# EAGLE schematic tracker (EAGLE 7.4.0)
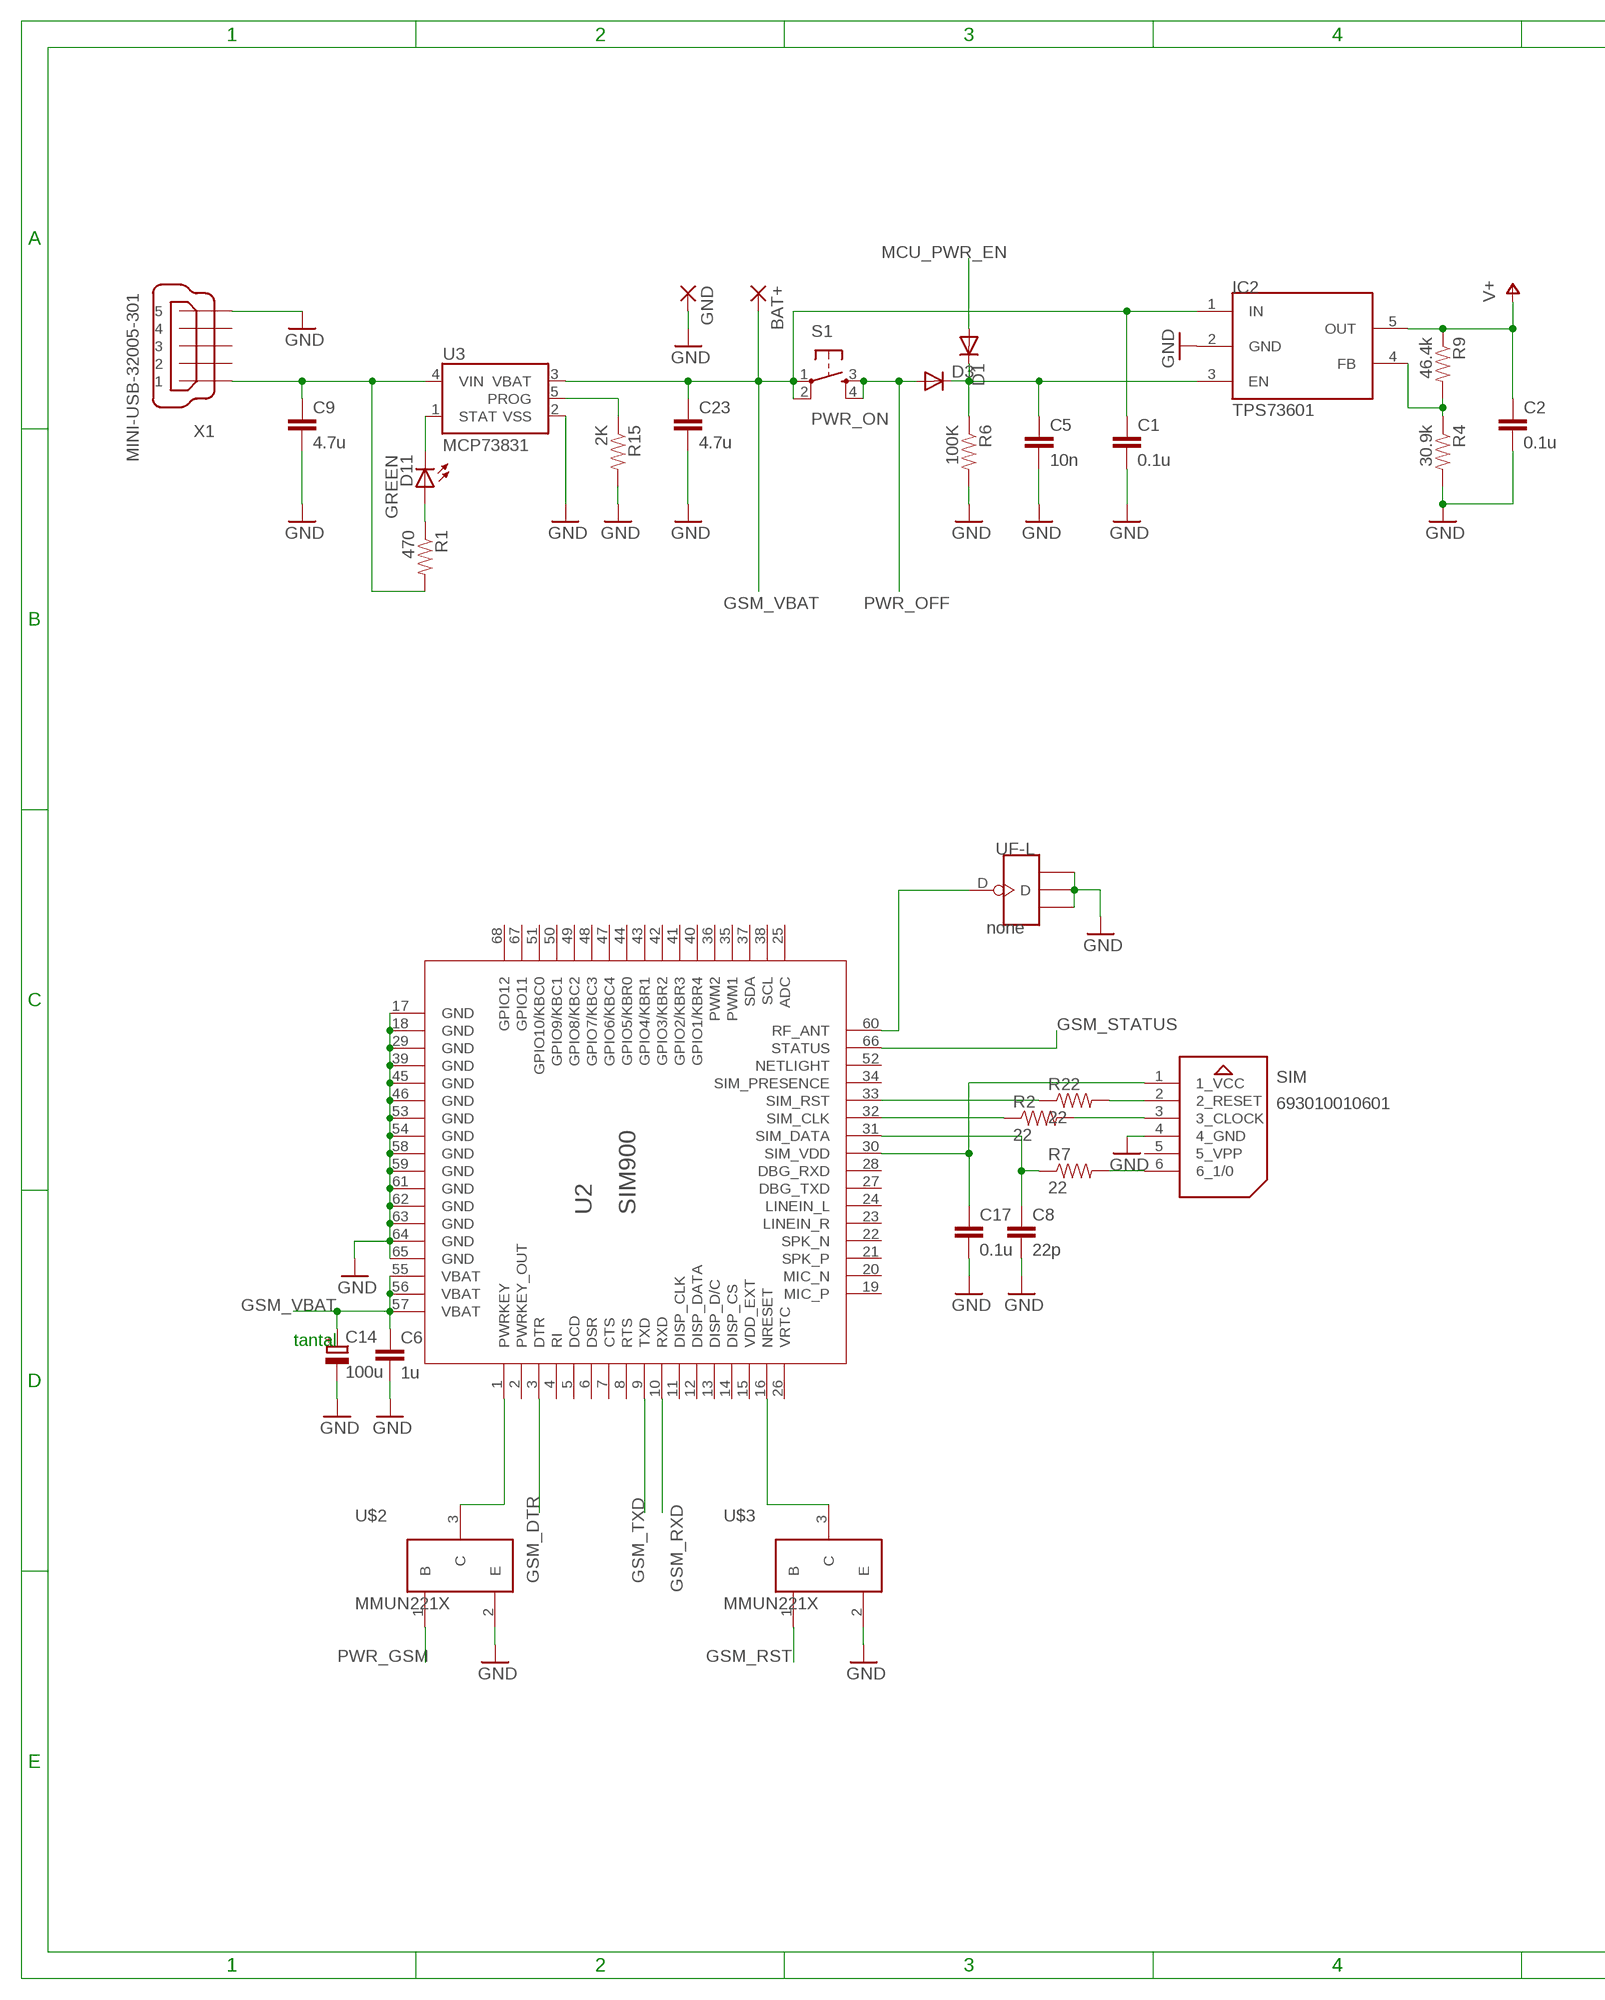
[diagram p0: schematic, sheet 1, part 1 of 2]
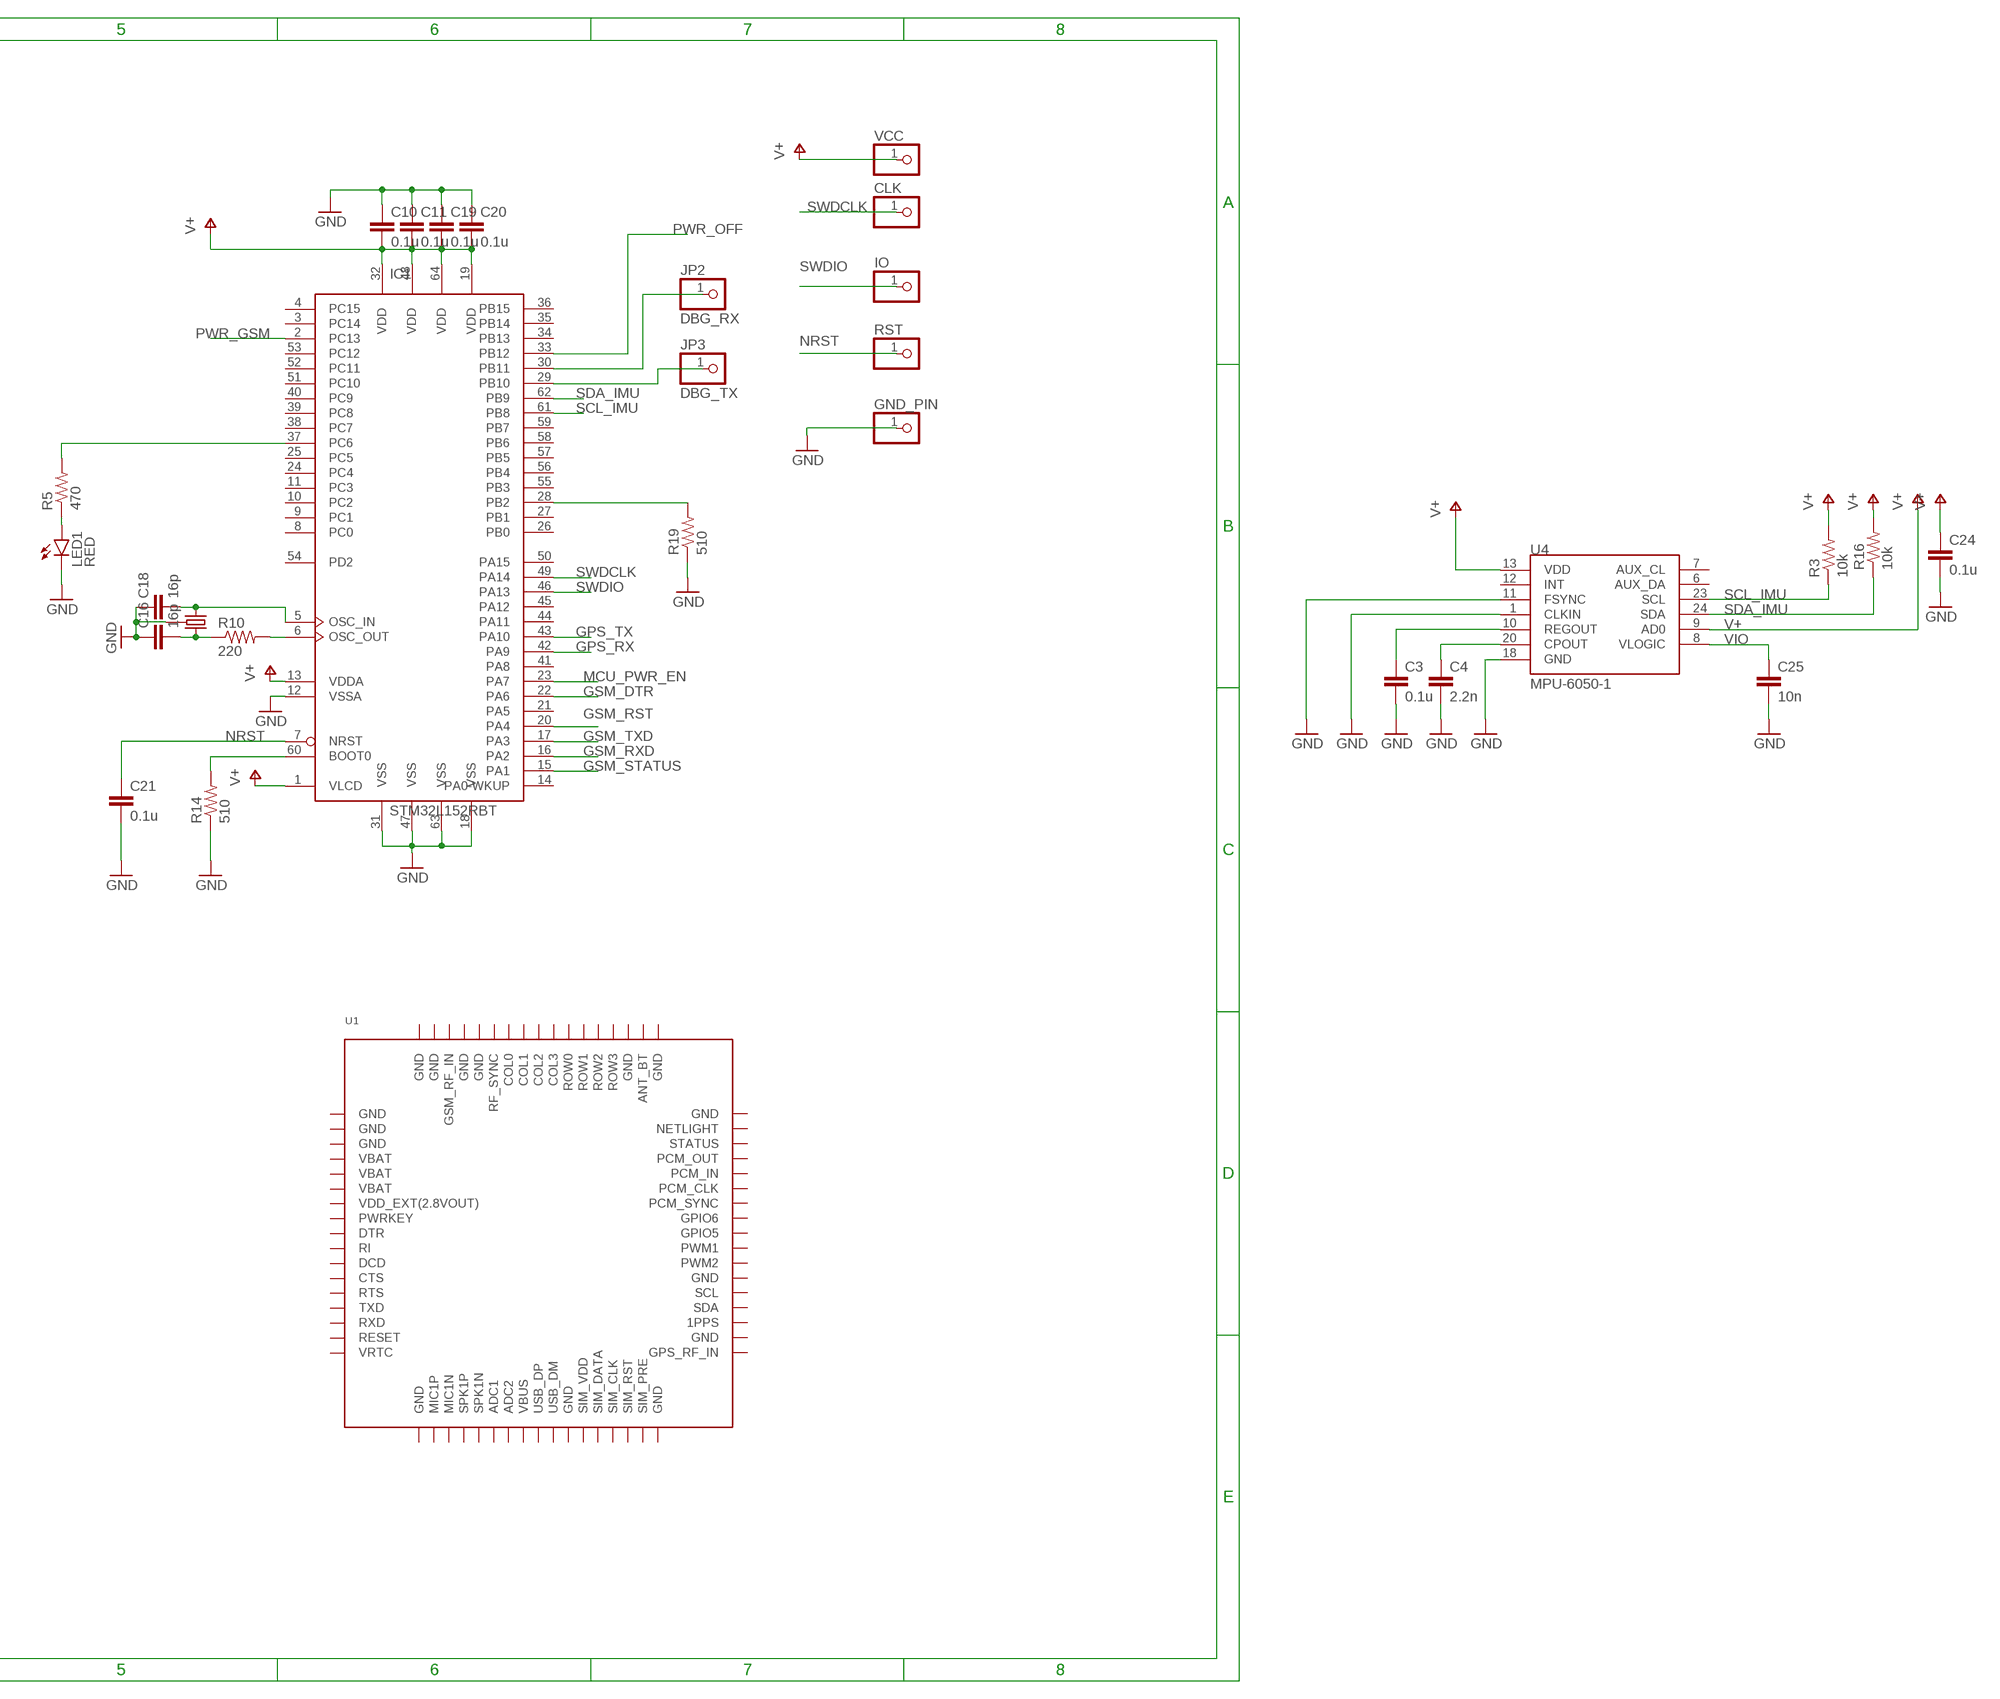
[diagram p1: schematic, sheet 1, part 2 of 2]

## Parts
BAT+  SMD2  [SMD1,27-2,54]
C1  0.1u  CAP0805  [0805]
C2  0.1u  CAP0805  [0805]
C3  0.1u  CAP0805  [0805]
C4  2.2n  CAP0805  [0805]
C5  10n  CAP0805  [0805]
C6  1u  CAP0805  [0805]
C8  22p  CAP0805  [0805]
C9  4.7u  CAP0805  [0805]
C10  0.1u  CAP0805  [0805]
C11  0.1u  CAP0805  [0805]
C14  100u  CPOL-EUC/6032-28R  [C/6032-28R]
C16  16p  CAP0603-CAP  [0603-CAP]
C17  0.1u  CAP0805  [0805]
C18  16p  CAP0603-CAP  [0603-CAP]
C19  0.1u  CAP0805  [0805]
C20  0.1u  CAP0805  [0805]
C21  0.1u  CAP0805  [0805]
C23  4.7u  CAP0805  [0805]
C24  0.1u  CAP0805  [0805]
C25  10n  CAP0805  [0805]
CLK  PINHD-1X1  [1X01]
D1  MBR0520LT  [SOD123]
D3  MBR0520LT  [SOD123]
D11  GREEN  LED0603  [LED-0603]
GND  SMD2  [SMD1,27-2,54]
GND_PIN  PINHD-1X1  [1X01]
IC1  STM32L152RBT  [LQFP64]
IC2  TPS73601  [SOT23]
IO  PINHD-1X1  [1X01]
JP2  DBG_RX  PINHD-1X1  [1X01]
JP3  DBG_TX  PINHD-1X1  [1X01]
LED1  RED  LED-RED0603  [LED-0603]
R1  470  RESISTOR0805-RES  [0805]
R2  22  RESISTOR0805-RES  [0805]
R3  10k  RESISTOR0805-RES  [0805]
R4  30.9k  RESISTOR0805-RES  [0805]
R5  470  RESISTOR0805-RES  [0805]
R6  100K  RESISTOR0805-RES  [0805]
R7  22  RESISTOR0805-RES  [0805]
R9  46.4k  RESISTOR0805-RES  [0805]
R10  220  RESISTOR0805-RES  [0805]
R14  510  RESISTOR0805-RES  [0805]
R15  2K  RESISTOR0805-RES  [0805]
R16  10k  RESISTOR0805-RES  [0805]
R19  510  RESISTOR0805-RES  [0805]
R22  22  RESISTOR0805-RES  [0805]
RST  PINHD-1X1  [1X01]
S1  PWR_ON  TAC_SWITCHPTH  [TACTILE-PTH]
SIM  693010010601  [693010010601]
U1  GSM_SIM808_LITERAL  [SIM900_SMT]
U2  SIM900  [SIM900]
U3  MCP73831  [SOT23-5]
U4  MPU-6050-1  [QFN-24-4MM2]
U$1  CRYSTAL-GROUNDED  [CRYSTAL-SMD-5X3]
U$2  MMUN221X  [MMUN221X]
U$3  MMUN221X  [MMUN221X]
UF-L  none  ANTENNA-U-FL  [4P-U-FL]
VCC  PINHD-1X1  [1X01]
X1  MINI-USB-32005-301  [32005-301]

## Nets
BOOT1: IC1.28(PB2) R19.2
GND: C1.2 C2.2 C3.2 C4.2 C5.2 C6.2 C8.2 C9.2 C10.1 C11.1 C14.- C16.1 C17.2 C18.1 C19.1 C20.1 C21.2 C23.2 C24.2 C25.2 GND.1(P) GND_PIN.1 IC1.12(VSSA) IC1.18(VSS) IC1.31(VSS) IC1.47(VSS) IC1.63(VSS) IC2.2(GND) LED1.C R4.2 R6.2 R14.1 R15.2 R19.1 SIM.4(4_GND) U2.17(GND) U2.18(GND) U2.29(GND) U2.39(GND) U2.45(GND) U2.46(GND) U2.53(GND) U2.54(GND) U2.58(GND) U2.59(GND) U2.61(GND) U2.62(GND) U2.63(GND) U2.64(GND) U2.65(GND) U3.2(VSS) U4.1(CLKIN) U4.11(FSYNC) U4.18(GND) U$1.2 U$1.4 U$2.2(E) U$3.2(E) UF-L.GND1 UF-L.GND2 UF-L.GND3 X1.5
GPS_RX: IC1.42(PA9)
GPS_TX: IC1.43(PA10)
GSM_DTR: IC1.22(PA6) U2.3(DTR)
GSM_RST: IC1.20(PA4) U$3.1(B)
GSM_RXD: IC1.16(PA2) U2.10(RXD)
GSM_STATUS: IC1.15(PA1) U2.66(STATUS)
GSM_TXD: IC1.17(PA3) U2.9(TXD)
GSM_VBAT: BAT+.1(P) C1.1 C6.1 C14.+ C23.1 IC2.1(IN) S1.1 S1.2 U2.55(VBAT) U2.56(VBAT) U2.57(VBAT) U3.3(VBAT)
MCU_PWR_EN: D1.A IC1.23(PA7)
N$1: U2.60(RF_ANT) UF-L.D
N$2: R7.2 SIM.6(6_1/0)
N$3: U2.16(NRESET) U$3.3(C)
N$5: R2.2 SIM.3(3_CLOCK)
N$6: R22.2 SIM.2(2_RESET)
N$7: IC1.37(PC6) R5.2
N$8: C18.2 IC1.5(OSC_IN) U$1.3
N$9: C16.2 R10.1 U$1.1
N$12: D11.A R1.1
N$13: IC2.4(FB) R4.1 R9.2
N$14: IC1.29(PB10) JP3.1
N$15: IC1.6(OSC_OUT) R10.2
N$16: IC1.60(BOOT0) R14.2
N$17: IC1.30(PB11) JP2.1
N$18: U2.1(PWRKEY) U$2.3(C)
N$27: LED1.A R5.1
N$29: C4.1 U4.20(CPOUT)
N$30: C3.1 U4.10(REGOUT)
NRST: C21.1 IC1.7(NRST) RST.1
PROG: R15.1 U3.5(PROG)
PWR_GSM: IC1.2(PC13) U$2.1(B)
PWR_OFF: D3.A IC1.33(PB12) S1.3 S1.4
SCL_IMU: IC1.61(PB8) R3.1 U4.23(SCL)
SDA_IMU: IC1.62(PB9) R16.1 U4.24(SDA)
SIM_CLK: R2.1 U2.32(SIM_CLK)
SIM_DATA: C8.1 R7.1 U2.31(SIM_DATA)
SIM_RST: R22.1 U2.33(SIM_RST)
SIM_VDD: C17.1 SIM.1(1_VCC) U2.30(SIM_VDD)
STAT: D11.C U3.1(STAT)
SWDCLK: CLK.1 IC1.49(PA14)
SWDIO: IC1.46(PA13) IO.1
V+: C2.1 C10.2 C11.2 C19.2 C20.2 C24.1 IC1.1(VLCD) IC1.13(VDDA) IC1.19(VDD) IC1.32(VDD) IC1.48(VDD) IC1.64(VDD) IC2.5(OUT) R3.2 R9.1 R16.2 U4.9(AD0) U4.13(VDD) VCC.1
VCC_GSM: C5.1 D1.C D3.C IC2.3(EN) R6.1
VIN1: C9.1 R1.2 U3.4(VIN) X1.1
VIO: C25.1 U4.8(VLOGIC)
Unconnected: IC1.3(PC14) IC1.4(PC15) IC1.8(PC0) IC1.9(PC1) IC1.10(PC2) IC1.11(PC3) IC1.14(PA0-WKUP) IC1.21(PA5) IC1.24(PC4) IC1.25(PC5) IC1.26(PB0) IC1.27(PB1) IC1.34(PB13) IC1.35(PB14) IC1.36(PB15) IC1.38(PC7) IC1.39(PC8) IC1.40(PC9) IC1.41(PA8) IC1.44(PA11) IC1.45(PA12) IC1.50(PA15) IC1.51(PC10) IC1.52(PC11) IC1.53(PC12) IC1.54(PD2) IC1.55(PB3) IC1.56(PB4) IC1.57(PB5) IC1.58(PB6) IC1.59(PB7) SIM.5(5_VPP) U1.P$8(PWRKEY) U1.P$9(DTR) U1.P$10(RI) U1.P$11(DCD) U1.P$12(CTS) U1.P$13(RTS) U1.P$14(TXD) U1.P$15(RXD) U1.P$16(RESET) U1.P$19(MIC1P) U1.P$20(MIC1N) U1.P$21(SPK1P) U1.P$22(SPK1N) U1.P$23(ADC1) U1.P$24(ADC2) U1.P$26(USB_DP) U1.P$27(USB_DM) U1.P$30(SIM_DATA) U1.P$31(SIM_CLK) U1.P$32(SIM_RST) U1.P$33(SIM_PRE) U1.P$35(GPS_RF_IN) U1.P$37(1PPS) U1.P$38(SDA) U1.P$39(SCL) U1.P$41(PWM2) U1.P$42(PWM1) U1.P$43(GPIO5) U1.P$44(GPIO6) U1.P$45(PCM_SYNC) U1.P$46(PCM_CLK) U1.P$47(PCM_IN) U1.P$48(PCM_OUT) U1.P$49(STATUS) U1.P$50(NETLIGHT) U1.P$53(ANT_BT) U1.P$55(ROW3) U1.P$56(ROW2) U1.P$57(ROW1) U1.P$58(ROW0) U1.P$59(COL3) U1.P$60(COL2) U1.P$61(COL1) U1.P$62(COL0) U1.P$63(RF_SYNC) U1.P$66(GSM_RF_IN) U2.2(PWRKEY_OUT) U2.4(RI) U2.5(DCD) U2.6(DSR) U2.7(CTS) U2.8(RTS) U2.11(DISP_CLK) U2.12(DISP_DATA) U2.13(DISP_D/C) U2.14(DISP_CS) U2.15(VDD_EXT) U2.19(MIC_P) U2.20(MIC_N) U2.21(SPK_P) U2.22(SPK_N) U2.23(LINEIN_R) U2.24(LINEIN_L) U2.25(ADC) U2.26(VRTC) U2.27(DBG_TXD) U2.28(DBG_RXD) U2.34(SIM_PRESENCE) U2.35(PWM1) U2.36(PWM2) U2.37(SDA) U2.38(SCL) U2.40(GPIO1/KBR4) U2.41(GPIO2/KBR3) U2.42(GPIO3/KBR2) U2.43(GPIO4/KBR1) U2.44(GPIO5/KBR0) U2.47(GPIO6/KBC4) U2.48(GPIO7/KBC3) U2.49(GPIO8/KBC2) U2.50(GPIO9/KBC1) U2.51(GPIO10/KBC0) U2.52(NETLIGHT) U2.67(GPIO11) U2.68(GPIO12) U4.6(AUX_DA) U4.7(AUX_CL) U4.12(INT) X1.2 X1.3 X1.4

## Notes on the sheet
- tantal

## Power pins joined to a net without a drawn wire
GND: U1.P$1(GND) U1.P$2(GND) U1.P$3(GND) U1.P$18(GND) U1.P$28(GND) U1.P$34(GND) U1.P$36(GND) U1.P$40(GND) U1.P$51(GND) U1.P$52(GND) U1.P$54(GND) U1.P$64(GND) U1.P$65(GND) U1.P$67(GND) U1.P$68(GND)
SIM_VDD: U1.P$29(SIM_VDD)
VBAT: U1.P$4(VBAT) U1.P$5(VBAT) U1.P$6(VBAT)
VBUS: U1.P$25(VBUS)
VDD_EXT(2.8VOUT): U1.P$7(VDD_EXT(2.8VOUT))
VRTC: U1.P$17(VRTC)

## Library data of the parts
BAT+ GND = wirepad:SMD2: SMD PAD
C1-C6 C8-C11 C16-C21 C23-C25 = SparkFun:CAP: Capacitor Standard 0603 ceramic capacitor, and 0.1" leaded capacitor.; OC_NEWARK: unknown
C14 = rcl:CPOL-EU: POLARIZED CAPACITOR, European symbol; OC_NEWARK: unknown
CLK GND_PIN IO JP2 JP3 RST VCC = pinhead:PINHD-1X1: PIN HEADER; OC_NEWARK: unknown
D1 D3 = diode:MBR0520LT: SCHOTTKY BARRIER RECTIFIER Source: http://onsemi.com .. MBR0520LT1-D.pdf; OC_NEWARK: unknown
D11 = SparkFun:LED: LEDs Standard schematic elements and footprints for 5mm, 3mm, 1206, and 0603 sized LEDs. 5mm - Spark Fun Electronics SKU : COM-00529 (and others); OC_NEWARK: unknown
IC1 = micro-stm_v2:STM32L152R*T: ARM 32-bit Cortex™-M3 CPU 32 MHz maximum frequency 32 to 384 Kbytes of Flash memory 4 to 12 kbytes of SRAM 51 GPIOs 1.8 to 3.6 V application supply; OC_NEWARK: unknown
IC2 = tps73xx:TPS73601; OC_NEWARK: unknown
LED1 = SparkFun-LED:LED-RED: Assorted Red LEDs LilyPad 1206- DIO-09912 1206- DIO-00809 0603- DIO-00819; OC_NEWARK: unknown; PROD_ID: DIO-00819
R1-R7 R9 R10 R14-R16 R19 R22 = SparkFun:RESISTOR: Resistor Basic schematic elements and footprints for 0603, 1206, and PTH resistors.; OC_NEWARK: unknown
S1 = SparkFun-Electromechanical:TAC_SWITCH: Momentary Switch Button commonly used for reset or general input. Spark Fun Electronics SKU : COM-00097 SMT- SWCH-08247; OC_NEWARK: unknown
SIM = Speicherkarten-SockelWR-CRD:693010010601: WR-CRDSIM CARD CONNECTOR HEADER 6PINS=>Code : Con_I-O_COM_CRD_SIM_Mini_693010010601 <http://katalog.we-online.de/media/images/eican/Con_I-O_COM_CRD_SIM_Mini_693010010601_pf2.jpg> Details see: http://katalog.we-online.de/en/em/693_010_010_601 Created 2014-07-09, Karrer Zheng 2014 (C) Würth Elektronik; OC_NEWARK: unknown
U1 = adafruit:GSM_SIM808_LITERAL: SIM808 GSM Module
U2 = ICs_v54:SIM900; OC_NEWARK: unknown
U3 = SparkFun:MCP73831: Microchip's MCP73831 Miniature single cell, fully integrated Li-Ion, Li-polymer charge management controller http://ww1.microchip.com/downloads/en/DeviceDoc/21984a.pdf; OC_NEWARK: unknown
U4 = Testing:MPU-6050; OC_NEWARK: unknown
U$1 = SparkFun-FreqCtrl:CRYSTAL-GROUNDED; OC_NEWARK: unknown
U$2 U$3 = mmun221X:MMUN221X
UF-L = Connector:ANTENNA-U-FL; OC_NEWARK: unknown
X1 = con-cypressindustries:MINI-USB-: MINI USB-B Conector Source: www.cypressindustries.com; OC_FARNELL: unknown; OC_NEWARK: unknown

## Net classes
0 default: clearance 0.152 mm